# EasyEDA schematic Controller.json
TITLE: Controller; REV: 1.0; Date: 2019-06-03; Sheet: 1/1; Drawn By: abdelhalem; Company: ?
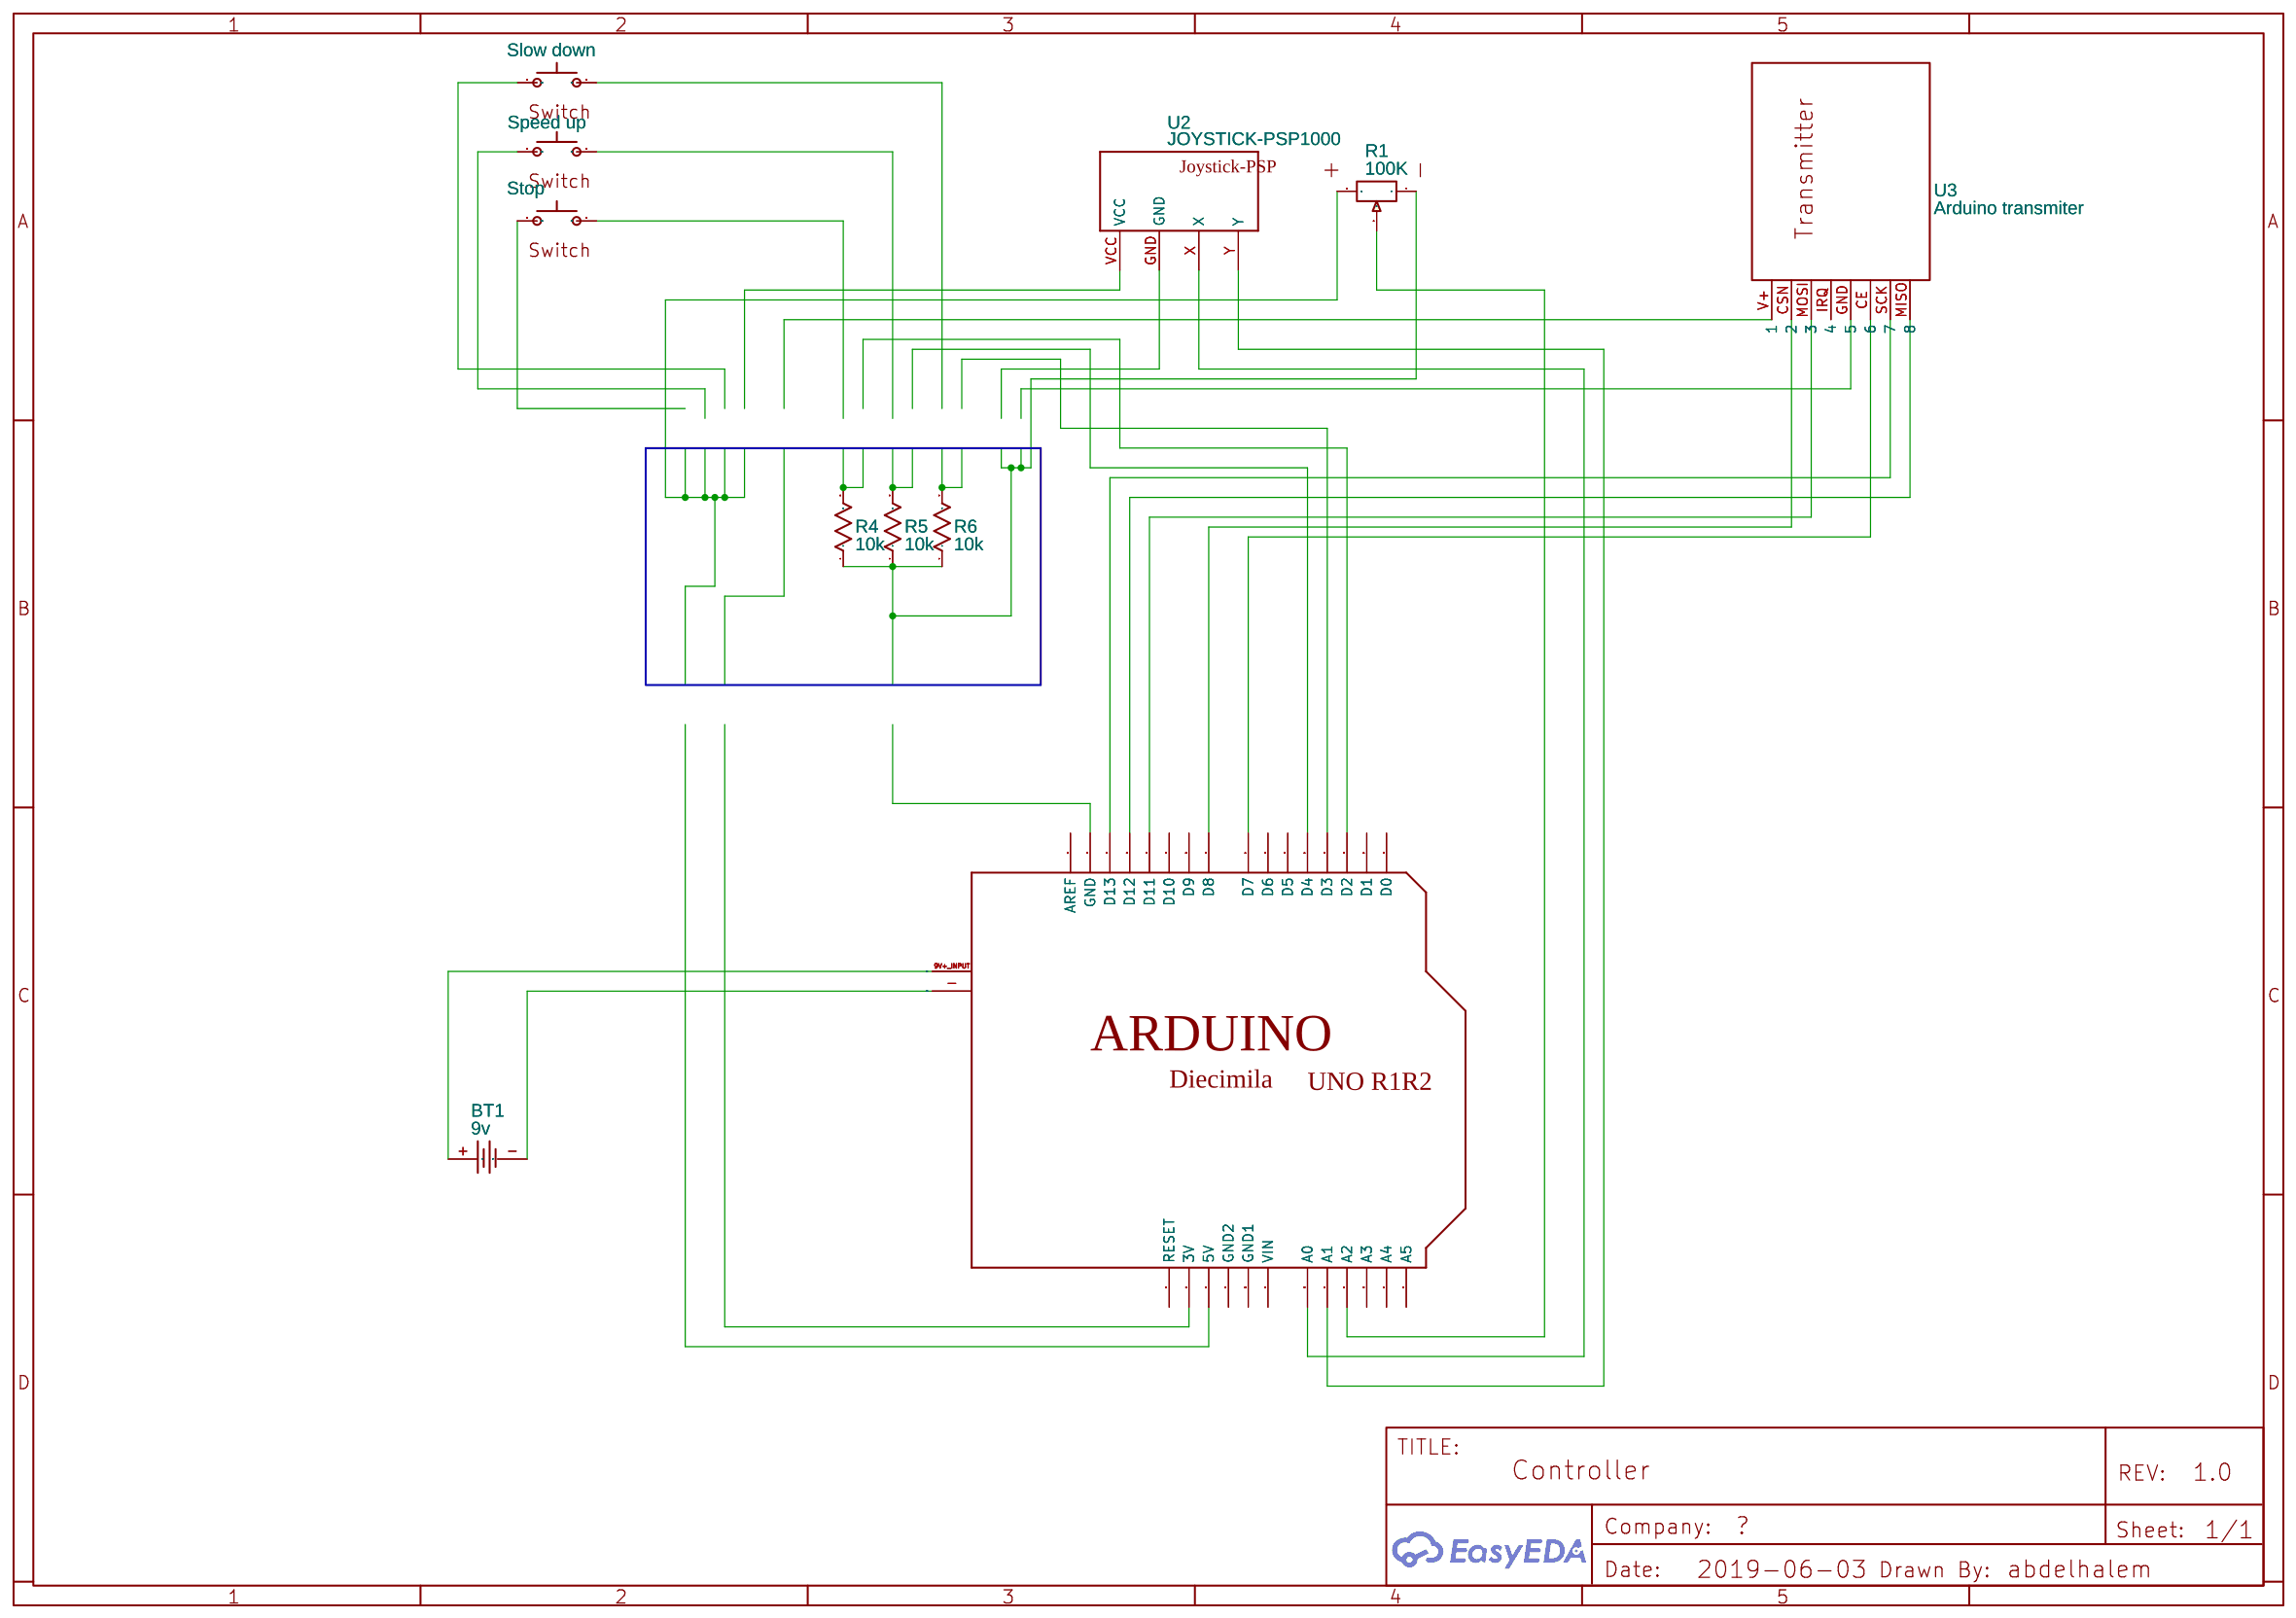
[diagram p0: schematic sheet]

## Parts
BT1  9v  [BATTERY-2]
R1  100K  [WH160-1-104]
R4  10k  [PKG-0.25W RESISTOR]
R5  10k  [PKG-0.25W RESISTOR]
R6  10k  [PKG-0.25W RESISTOR]
SW-1SWITCH  Slow down  [SW-08]
SW-2SWITCH  Speed up  [SW-08]
SW-3SWITCH  Stop  [SW-08]
U1  ARDUINO (with input power)  [ARDUINO]
U2  JOYSTICK-PSP1000  [JOYSTICK-PSP1000]
U3  Arduino transmiter

## Library data of the parts
BT1 = -: Supplier: LCSC; Supplier Part: C238068; Manufacturer: Keystone; Manufacturer Part: 1056TR; Contributor: LCSC
R1 = Potentiometer_WH160-1-104: Supplier: LCSC; Manufacturer: JML; Manufacturer Part: Potentiometer WH160-1-104; Supplier Part: C61836; Contributor: abdelhalem
R4-R6 = -: Power: 1/4W; Tolerance: ±5%; Supplier Part: 9339116; Supplier: Element14; Manufacturer: MULTICOMP; Manufacturer Part: MCF 0.25W 10K; Link: http://www.farnell.com/datasheets/1716725.pdf?_ga=2.130313612.2023696496.1506695686-238689616.1505921947&_gac=1.45287312.1506011718.EAIaIQobChMI57GX6tq21gIVTzobCh2WXgT2EAAYASAAEgKn9_D_BwE; Contributor: Prof. Ing. F. Scordino
SW-1SWITCH SW-2SWITCH SW-3SWITCH U1 = -: Contributor: abdelhalem; Manufacturer Part: ?
U2 = -: Contributor: SparkFun; Manufacturer Part: ?
U3 = -: Manufacturer Part: ?; Contributor: abdelhalem

## Nets
Net-(BT1-+): BT1.+(1) U1.9V+ INPUT(D14)
Net-(BT1--): BT1.-(2) U1.-(D15)
Net-(R1-1): R1.1 R4.1 R5.1 R6.1
Net-(R1-2): R1.2 U1.A2
Net-(U1-A0): U1.A0 U2.X
Net-(U1-A1): U1.A1 U2.Y
Net-(U1-D11): U1.D11 U3.MOSI(3)
Net-(U1-D12): U1.D12 U3.MISO(8)
Net-(U1-D13): U1.D13 U3.SCK(7)

Not connected (* = marked no-connect by the designer): R1 3; R4 2; R5 2; R6 2; SW-1SWITCH P$2(P$1) P$3(P$2); SW-2SWITCH P$2(P$1) P$3(P$2); SW-3SWITCH P$2(P$1) P$3(P$2); U1 3V 5V A3 A4 A5 AREF D0 D1 D2 D3 D4 D5 D6 D7 D8 D9 D10 GND GND1 GND2 RESET VIN; U2 GND VCC; U3 CE(6) CSN(2) GND(5) IRQ(4) V+(1)
